# EAGLE design just_a_switch-mk-2.1 (EAGLE 6.5.0)
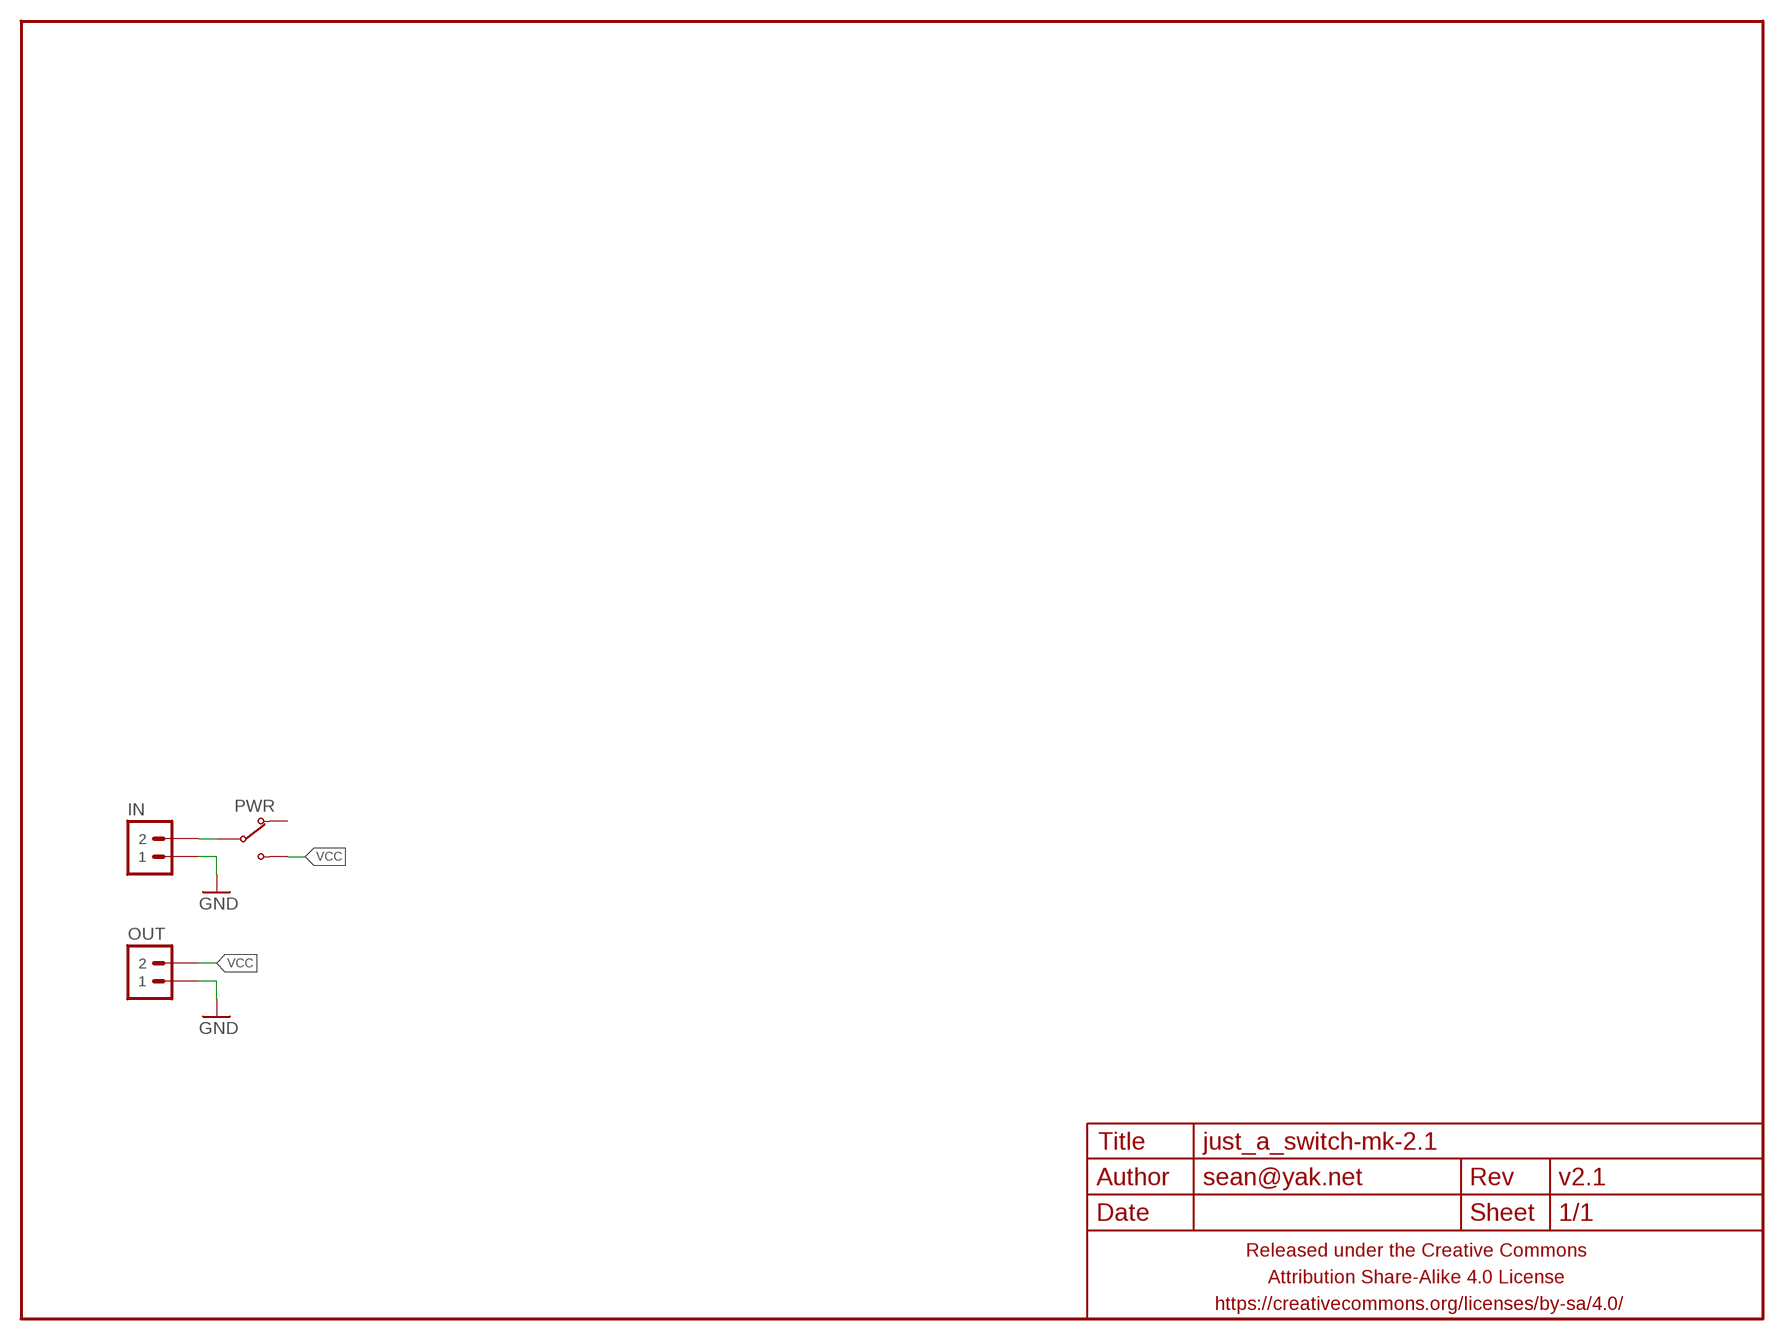
[diagram p0: schematic, sheet 1]

## Parts
FRAME1  FRAME-LETTERNO_PACKAGE  [DUMMY]
IN  M02JST-PH-VERT-R+  [JST-2-PH-VERT-PTH-R+]
OUT  M02JST-PH-VERT-R+  [JST-2-PH-VERT-PTH-R+]
PWR  SWITCH-SPDTPTH-RA-2.54MM  [SPDT-RA-2.54MM]

## Nets
GND: IN.1 OUT.1
N$1: IN.2 PWR.2(COM)
VCC: OUT.2 PWR.3(NO)
Unconnected: PWR.1(NC)

## Library data of the parts
FRAME1 = a_parts:FRAME-LETTER: Schematic Frame Standard 8.5x11 US Letter frame; DESIGNER: sean@yak.net; VERSION: v2.1
IN OUT = a_parts:M02: Standard 2-pin 0.1" header. Use with - straight break away headers ( PRT-00116) - right angle break away headers (PRT-00553) - swiss pins (PRT-00743) - machine pins (PRT-00117) - female headers (PRT-00115) Molex polarized connector foot print use with: PRT-08233 with associated crimp pins and housings. 2.54_SCREWTERM for use with PRT-10571. 3.5mm Screw Terminal footprints for PRT-08084 5mm Screw Terminal footprints for use with PRT-08433
PWR = a_parts:SWITCH-SPDT

## Board
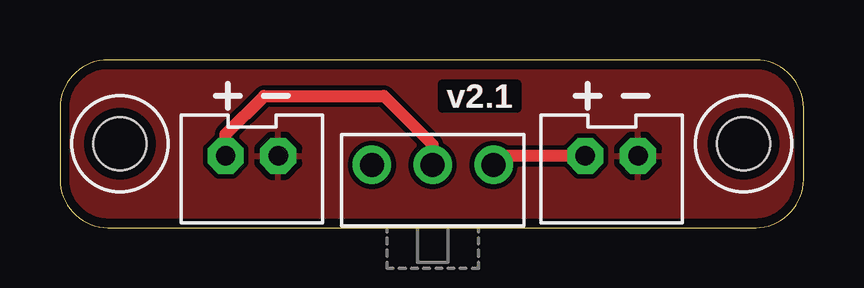
[diagram p1: board, top side]
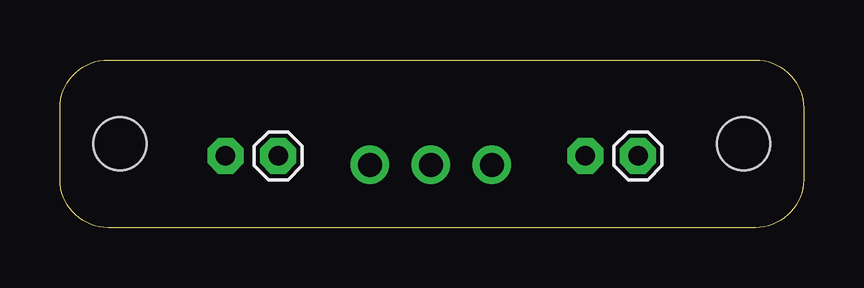
[diagram p2: board, bottom side, seen from below]

Size 31 x 7 mm. Coordinates in mm from the lower left corner, seen from the top.
Outline: 29,7 2,7 arc90 0,5 0,2 arc90 2,0 29,0 arc90 31,2 31,5 arc90 29,7
Copper layers (1*16): Top 0.0356mm / dielectric 1.5011mm / Bottom 0.0356mm
Design rules "LaenPCBOrder_2": minimum track width 6mil, minimum drill 13mil, track to track 6mil, track to pad 6mil, pad to pad 6mil, via to via 6mil, smd to smd 6mil, copper to edge 15mil, drill to drill 6mil, minimum pad ring 7mil, minimum via ring 7mil, stop-mask expansion 3mil, vias tented up to drill 20mil, thermal gap 10mil
Holes 2.2 mm at 2.5,3.5 28.5,3.5

### Footprints (pad centres in the part's own frame; a part is rotated, then mirrored left to right if it is on the bottom)
JST-2-PH-VERT-PTH-R+ = drill 0.8 pad 1.5 octagon: 1 -1.1,0; 2 1.1,0
SPDT-RA-2.54MM = drill 1 pad 1.6: 1 0,0; 2 2.54,0; 3 5.08,0

### Placement (x,y rotation side)
FRAME1  0,0 0 top
IN  8,3 180 top
OUT  23,3 180 top
PWR  13,2.62 0 top

### Tracks (layer width: path | path; a pad name or v marks a point on that pad's centre or on a via)
GND
  pour Top (isolate 0.2): 29,0 2,0 arc-90 0,2 0,5 arc-90 2,7 29,7 arc-90 31,5 31,2 arc-90
N$1
  Top 0.5: IN.2 6.9,3.9 8.5,5.5 13.5,5.5 15.54,3.46 PWR.2
VCC
  Top 0.5: OUT.2 18.46,3 PWR.3